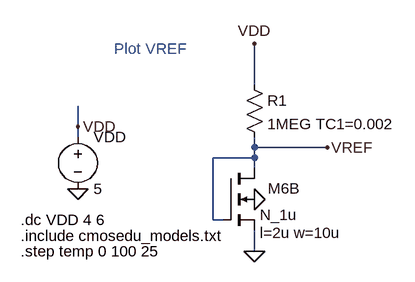
[diagram p0: schematic Fig23_4.asc]
Fig23_4.asc, the LTspice schematic file:
Version 4
SHEET 1 1784 680
WIRE 1376 -96 1376 -160
WIRE 1104 -32 1104 -64
WIRE 1104 -16 1104 -32
WIRE 1376 0 1376 -16
WIRE 1488 0 1376 0
WIRE 1376 16 1376 0
WIRE 1376 16 1312 16
WIRE 1376 32 1376 16
WIRE 1312 112 1312 16
WIRE 1328 112 1312 112
WIRE 1376 160 1376 128
FLAG 1104 64 0
FLAG 1104 -32 VDD
FLAG 1376 80 0
FLAG 1376 160 0
FLAG 1376 -160 VDD
FLAG 1488 0 VREF
SYMBOL voltage 1104 -32 R0
WINDOW 123 0 0 Left 0
WINDOW 39 0 0 Left 0
SYMATTR InstName VDD
SYMATTR Value 5
SYMBOL nmos4 1328 32 R0
WINDOW 123 56 100 Left 0
WINDOW 0 69 31 Left 0
SYMATTR Value2 l=2u w=10u
SYMATTR InstName M6B
SYMATTR Value N_1u
SYMBOL res 1360 -112 R0
SYMATTR InstName R1
SYMATTR Value 1MEG TC1=0.002
TEXT 1016 136 Left 0 !.include cmosedu_models.txt
TEXT 1160 -152 Left 0 ;Plot VREF
TEXT 1016 112 Left 0 !.dc VDD 4 6 
TEXT 1016 160 Left 0 !.step temp 0 100 25

The netlist it stands for:
* Fig23_4.asc
VDD VDD 0 5
M6B VREF VREF 0 0 N_1u l=2u w=10u
R1 VDD VREF 1MEG TC1=0.002
.model NMOS NMOS
.model PMOS PMOS
.lib standard.mos
.include cmosedu_models.txt
* Plot VREF
.dc VDD 4 6
.step temp 0 100 25
.backanno
.end